# Altium schematic sheet Power.SchDoc
size Tabloid; DocumentNumber: 2; SheetNumber: 2; SheetTotal: 11; SheetName: Main power supply
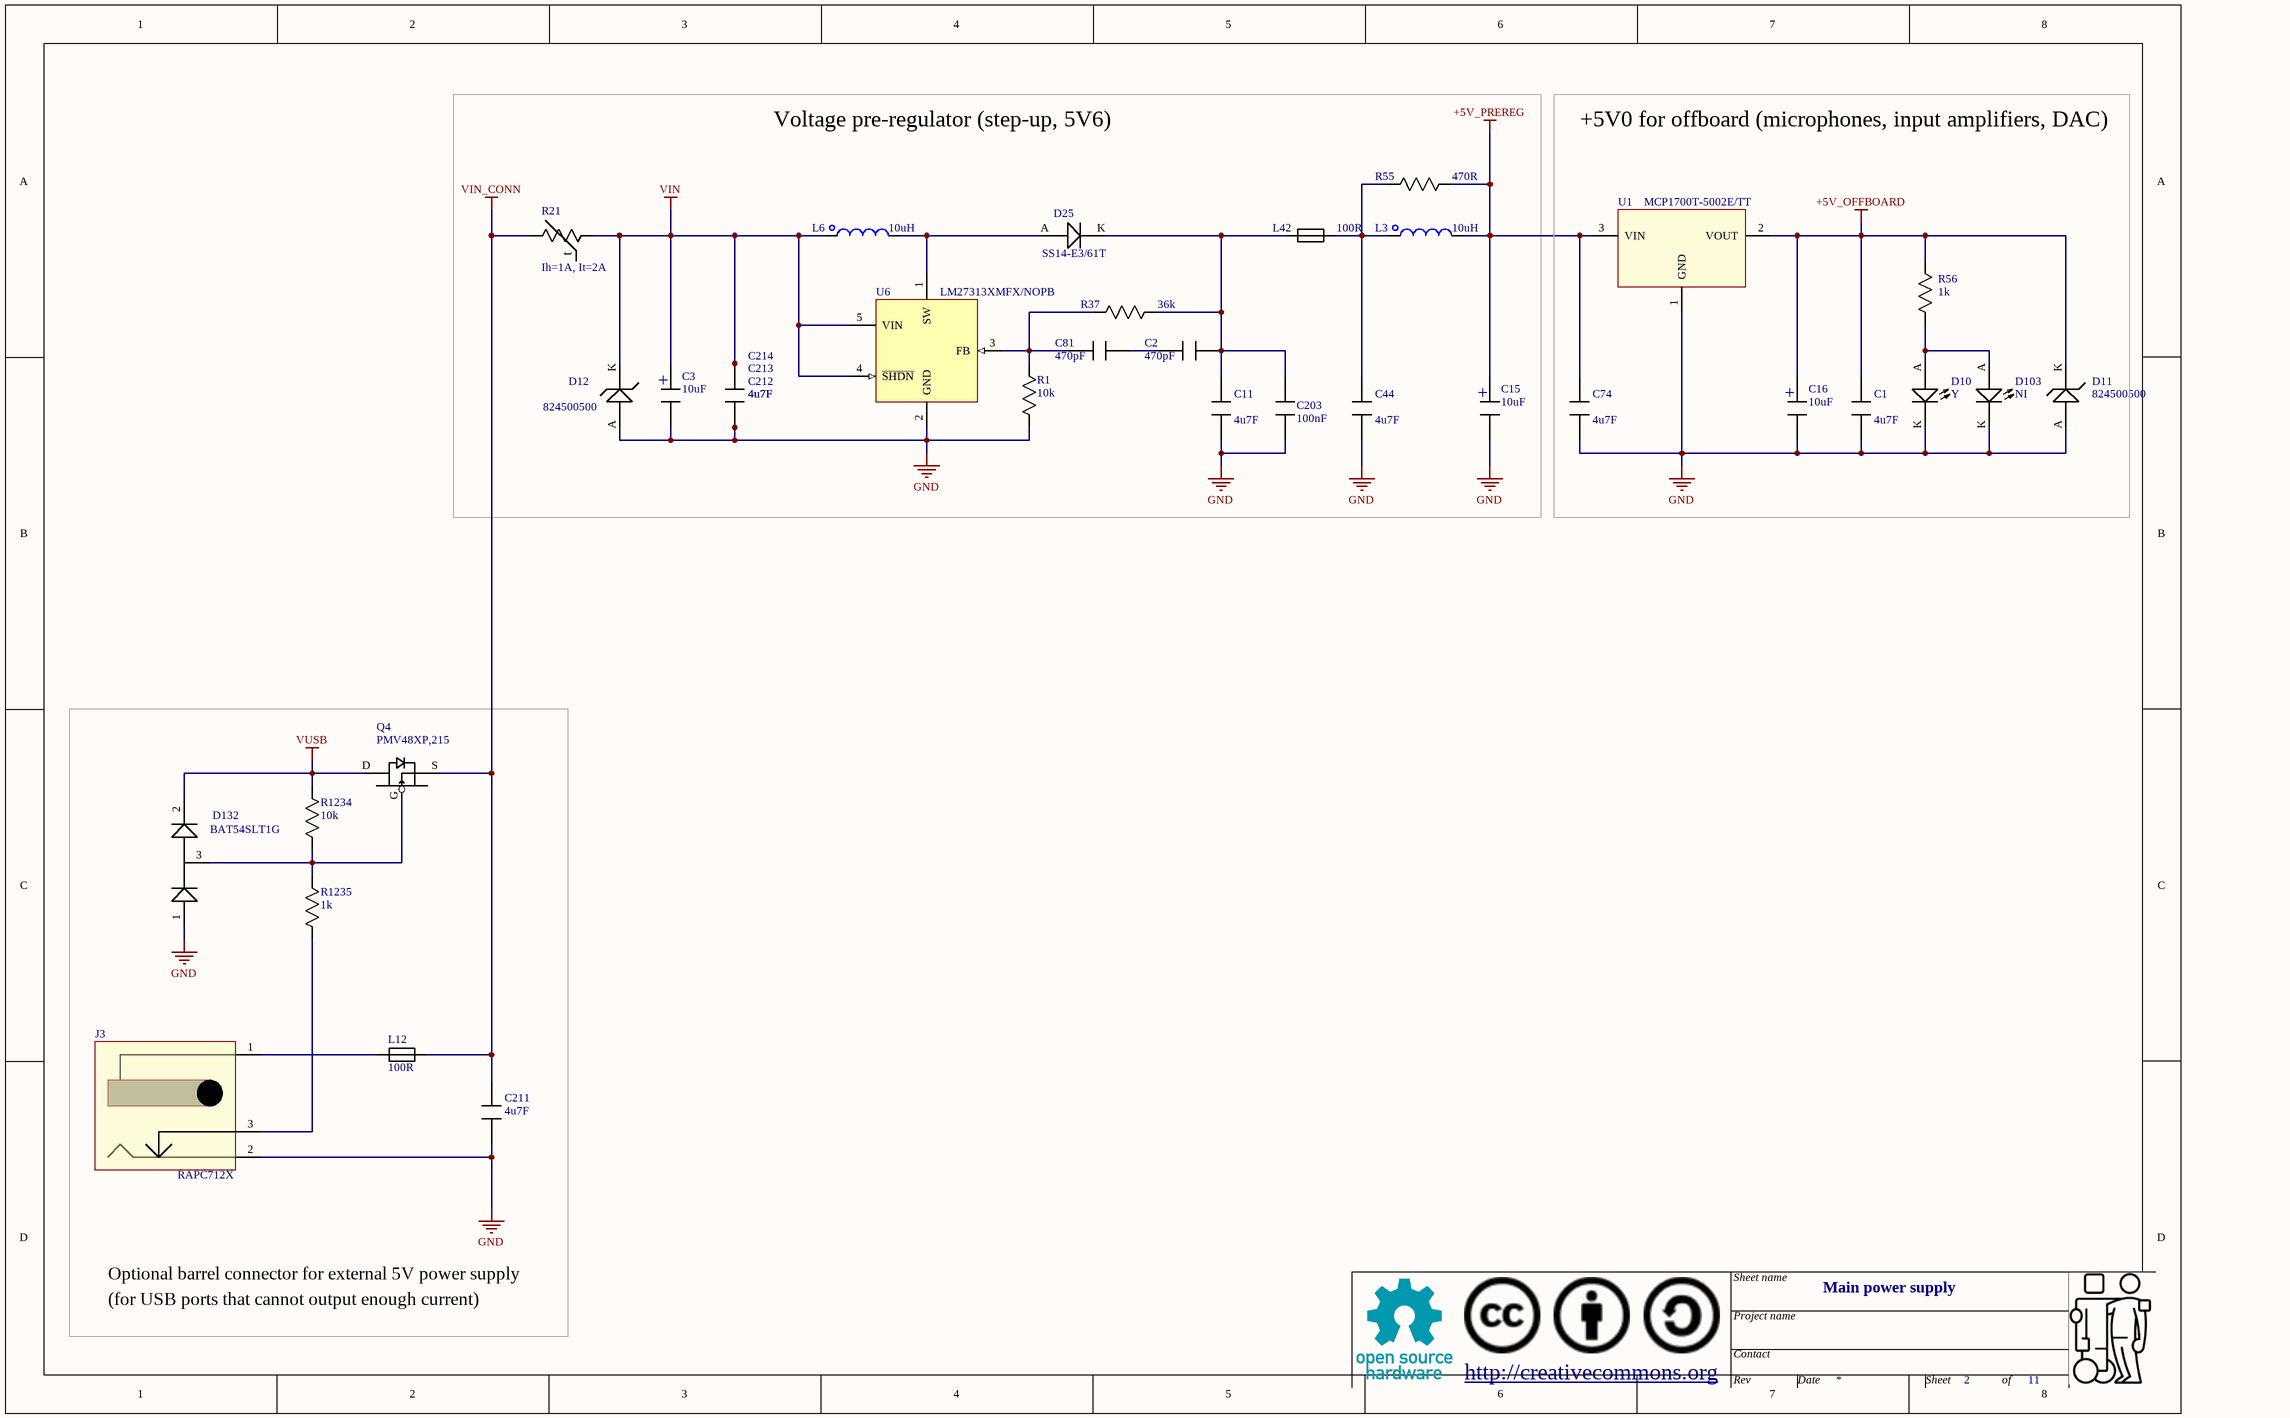
[diagram p0: Power.SchDoc]

## Parts
C1  value 4u7F  [0805]  (hidden comment: Capacitor)
C2  value 470pF  [0603]  (hidden comment: Capacitor)
C3  value 10uF  [CAP_RAD_SMD_DIA157]  (hidden comment: Capacitor_Polarized)
C11  value 4u7F  [0805]  (hidden comment: Capacitor)
C15  value 10uF  [CAP_RAD_SMD_DIA157]  (hidden comment: Capacitor_Polarized)
C16  value 10uF  [CAP_RAD_SMD_DIA157]  (hidden comment: Capacitor_Polarized)
C44  value 4u7F  [0805]  (hidden comment: Capacitor)
C74  value 4u7F  [0805]  (hidden comment: Capacitor)
C81  value 470pF  [0603]  (hidden comment: Capacitor)
C203  value 100nF  [0603]  (hidden comment: Capacitor)
C211  value 4u7F  [0805]  (hidden comment: Capacitor)
C212  value 4u7F  [0805]  (hidden comment: Capacitor)
C213  value 4u7F  [0805]  (hidden comment: Capacitor)
C214  value 4u7F  [0805]  (hidden comment: Capacitor)
D10  Type: Y  [0805_LED]  (hidden comment: Diode_LED)
D11  Mfg_PN: 824500500  [DIODE_DO-214AC/SMA]  (hidden comment: Diode_zener)
D12  Mfg_PN: 824500500  [DIODE_DO-214AC/SMA]  (hidden comment: Diode_zener)
D25  Mfg_PN: SS14-E3/61T  [DIODE_SMA]  (hidden comment: Diode)
D103  Diode_LED  [0805_LED]  (value not drawn)
D132  Mfg_PN: BAT54SLT1G  [SOT23_132]  (hidden comment: Diode_dual)
J3  Mfg_PN: RAPC712X  [CONN_2.5mmID5.5mmOD_RAPC712X]  (hidden comment: CON_POWER_RAPC712X)
L3  value 10uH  [IND_252012CDMC/DS]  (hidden comment: Inductor)
L6  value 10uH  [IND_252012CDMC/DS]  (hidden comment: Inductor)
L12  value 100R  [0805]  (hidden comment: Ferrite)
L42  value 100R  [0805]  (hidden comment: Ferrite)
Q4  Mfg_PN: PMV48XP,215  [SOT23_GDS]  (hidden comment: MOSFET_P_GDS)
R1  value 10k  [0603]  (hidden comment: Resistor)
R21  value Ih=1A, It=2A  [0805]  (hidden comment: Resistor_PTC)
R37  value 36k  [0603]  (hidden comment: Resistor)
R55  value 470R  [0603]  (hidden comment: Resistor)
R56  value 1k  [0603]  (hidden comment: Resistor)
R1234  value 10k  [0603]  (hidden comment: Resistor)
R1235  value 1k  [0603]  (hidden comment: Resistor)
U1  Mfg_PN: MCP1700T-5002E/TT  [SOT23_132]  (hidden comment: MCP1700)
U6  LM27313XMFX/NOPB  [MF05A_N]

## Blocks framed on the sheet
Voltage pre-regulator (step-up, 5V6): C2 C3 C11 C15 C44 C81 C203 C212-C214 D12 D25 L3 L6 L42 R1 R21 R37 R55 U6
+5V0 for offboard (microphones, input amplifiers, DAC): C1 C16 C74 D10 D11 D103 R56 U1

## Nets
+5V_OFFBOARD: C1.1 C16.+ D11.K R56.2 U1.2(VOUT)
+5V_PREREG: C15.+ C74.1 L3.2 R55.1 U1.3(VIN)
GND: C1.2 C3.- C11.2 C15.- C16.- C44.2 C74.2 C203.2 C211.2 C212.2 C213.2 C214.2 D10.K D11.A D12.A D103.K D132.1(K) J3.2(GROUND) R1.2 U1.1(GND) U6.2(GND)
VIN: C3.+ C212.1 C213.1 C214.1 D12.K L6.1 R21.2 U6.4(~{SHDN}) U6.5(VIN)
VIN_CONN: C211.1 L12.2 Q4.S R21.1
VUSB: D132.2(K) Q4.D R1234.2
NetC2_1: C2.1 C81.2
NetC2_2: C2.2 C11.1 C203.1 D25.K L42.1 R37.2
NetC44_1: C44.1 L3.1 L42.2 R55.2
NetC81_1: C81.1 R1.1 R37.1 U6.3(FB)
NetD10_A: D10.A D103.A R56.1
NetD25_A: D25.A L6.2 U6.1(SW)
NetD132_3: D132.3(AK) Q4.G R1234.1 R1235.2
NetJ3_1: J3.1(CENTER) L12.1
NetJ3_3: J3.3(SW/BATT) R1235.1

## Notes on the sheet
- Optional barrel connector for external 5V power supply
- (for USB ports that cannot output enough current)
- Sheet name
- http://creativecommons.org
- Project name
- Contact
- Rev
- Date
- Sheet
- of
- (in symbol Resistor_PTC) t

## Library data of the parts
C1 C11 C44 C74 C211-C214 = Capacitor: Mfg: Samsung; Mfg_PN: CL21A475KAQNNNG; HelpURL: *; NI: *; Supplier1: Digikey; Supplier1_PN: 1276-6462-1-ND; Tolerance: *; Type: *; Rating: *
C2 C81 = Capacitor: Mfg: Samsung; Mfg_PN: CL10C471JB8NCNC; HelpURL: *; NI: *; Supplier1: Digikey; Supplier1_PN: 1276-2302-1-ND; Tolerance: *; Type: *; Rating: *
C3 C15 C16 = Capacitor_Polarized: Capacitor; Mfg: Nichicon; Mfg_PN: UWX1C100MCL1GB; HelpURL: *; NI: *; Supplier1: Digikey; Supplier1_PN: 493-2100-1-ND; Tolerance: *; Type: *; Rating: *
C203 = Capacitor: Mfg: Samsung; Mfg_PN: CL10F104ZO8NNNC; HelpURL: *; NI: NI; Supplier1: Digikey; Supplier1_PN: 1276-1258-1-ND; Tolerance: *; Type: *; Rating: *
D10 = Diode_LED: LED; Mfg: Osram; Mfg_PN: LY R976-PS-36; HelpURL: *; NI: *; Supplier1: Digikey; Supplier1_PN: 475-2560-1-ND; Tolerance: *; Rating: *; Value: *
D11 D12 = Diode_zener: Diode; Mfg: Wurth; HelpURL: *; NI: *; Supplier1: Digikey; Supplier1_PN: 732-9974-1-ND; Tolerance: *; Type: *; Rating: *; Value: *
D25 = Diode: Mfg: Vishay; HelpURL: *; NI: *; Supplier1: Digikey; Supplier1_PN: SS14-E3/61TGICT-ND; Tolerance: *; Type: *; Rating: *; Value: *
D103 = Diode_LED: LED; Type: G; HelpURL: *; Mfg: *; Mfg_PN: *; NI: NI; Supplier1: *; Supplier1_PN: *; Tolerance: *; Rating: *; Value: *
D132 = Diode_dual: Diode; Mfg: Onsemi; HelpURL: *; NI: *; Supplier1: Digikey; Supplier1_PN: BAT54SLT1GOSCT-ND; Tolerance: *; Type: *; Rating: *; Value: *
J3 = CON_POWER_RAPC712X: Power barrel connector, through-hole, 2.5mm ID,; Mfg: Switchcraft Inc.; HelpURL: *; NI: *; Rating: *; Supplier1: Digikey; Supplier1_PN: SC237-ND; Tolerance: *; Type: *; Value: *
L3 L6 = Inductor: Mfg: Murata; Mfg_PN: DFE252012F-100M=P2; HelpURL: *; NI: *; Rating: *; Tolerance: *; Supplier1: Digikey; Supplier1_PN: 490-13050-1-ND
L12 L42 = Ferrite: Mfg: Bourns; Mfg_PN: MH2029-101Y; Rating: 1A; HelpURL: *; NI: *; Supplier1: Digikey; Supplier1_PN: MH2029-101YCT-ND; Tolerance: *; Type: *
Q4 = MOSFET_P_GDS: PMOS; Mfg: NXP; HelpURL: *; NI: *; Rating: *; Supplier1: Digikey; Supplier1_PN: 568-7579-1-ND; Tolerance: *; Type: *; Value: *
R1 R1234 = Resistor: Mfg: Yageo; Mfg_PN: RC0603JR-0710KL; HelpURL: *; NI: *; Supplier1: Digikey; Supplier1_PN: 311-10KGRCT-ND; Type: *; Rating: *; Tolerance: *
R21 = Resistor_PTC: Mfg: Bel fuse; Mfg_PN: 0ZCK0100FF2E; HelpURL: *; NI: *; Supplier1: Digikey; Supplier1_PN: 507-1815-1-ND; Type: *; Rating: *; Tolerance: *
R37 = Resistor: Mfg: Yageo; Mfg_PN: RC0603JR-0736KL; HelpURL: *; NI: *; Supplier1: Digikey; Supplier1_PN: 311-36KGRCT-ND; Type: *; Rating: *; Tolerance: *
R55 = Resistor: Mfg: Yageo; Mfg_PN: RC0603JR-07470RL; HelpURL: *; NI: *; Supplier1: Digikey; Supplier1_PN: 311-470GRCT-ND; Type: *; Rating: *; Tolerance: *
R56 R1235 = Resistor: Mfg: Yageo; Mfg_PN: RC0603JR-071KL; HelpURL: *; NI: *; Supplier1: Digikey; Supplier1_PN: 311-1.0KGRCT-ND; Type: *; Rating: *; Tolerance: *
U1 = MCP1700: Linear voltage regulator; Mfg: Microchip; HelpURL: http://ww1.microchip.com/downloads/en/DeviceDoc/20001826C.pdf; NI: *; Supplier1: Digikey; Supplier1_PN: MCP1700T5002ETTCT-ND; Type: *
U6 = LM27313XMFX/NOPB: 1.6 MHz Boost Converter With 30V Internal FET Switch, 5-pin SOT-23, Pb-Free, 3000 Reel; Mfg: TI; Mfg_PN: LM27313XMF/NOPB; Supplier1: Digikey; Supplier1_PN: LM27313XMF/NOPBCT-ND